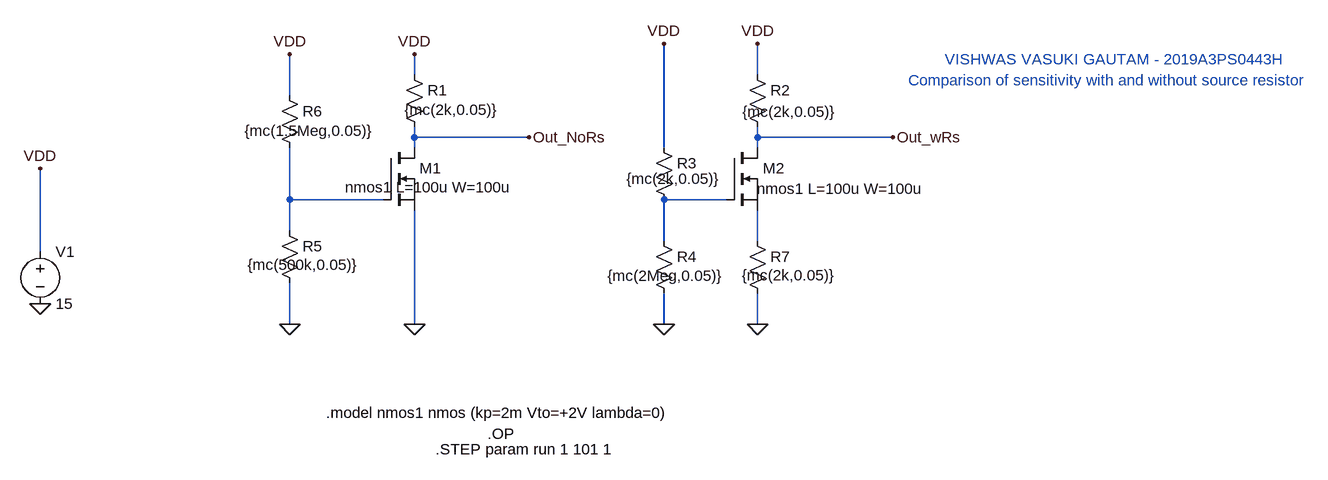
[diagram p0: schematic Sensitivity_in_biasing_lab8.asc]
Sensitivity_in_biasing_lab8.asc, the LTspice schematic file:
Version 4
SHEET 1 1424 680
WIRE -96 -288 -96 -320
WIRE 432 -288 432 -336
WIRE -288 -256 -288 -320
WIRE -96 -192 -96 -208
WIRE 80 -192 -96 -192
WIRE 432 -192 432 -208
WIRE 640 -192 432 -192
WIRE -96 -176 -96 -192
WIRE 288 -176 288 -336
WIRE 432 -176 432 -192
WIRE -288 -96 -288 -176
WIRE -144 -96 -288 -96
WIRE 384 -96 288 -96
WIRE -288 -48 -288 -96
WIRE 288 -32 288 -96
WIRE 432 -32 432 -80
WIRE -672 -16 -672 -144
WIRE -288 96 -288 32
WIRE -96 96 -96 -80
WIRE 288 96 288 48
WIRE 432 96 432 48
FLAG -672 64 0
FLAG -672 -144 VDD
FLAG -288 -320 VDD
FLAG -96 -320 VDD
FLAG 288 -336 VDD
FLAG 432 -336 VDD
FLAG -288 96 0
FLAG -96 96 0
FLAG 288 96 0
FLAG 432 96 0
FLAG 80 -192 Out_NoRs
FLAG 640 -192 Out_wRs
SYMBOL nmos -144 -176 R0
WINDOW 3 200 61 Right 2
SYMATTR Value nmos1 L=100u W=100u
SYMATTR InstName M1
SYMBOL nmos 384 -176 R0
WINDOW 3 47 63 Left 2
SYMATTR Value nmos1 L=100u W=100u
SYMATTR InstName M2
SYMBOL res -112 -304 R0
WINDOW 3 1 70 Left 2
SYMATTR Value {mc(2k,0.05)}
SYMATTR InstName R1
SYMBOL voltage -672 -32 R0
WINDOW 123 0 0 Left 2
WINDOW 39 0 0 Left 2
SYMATTR InstName V1
SYMATTR Value 15
SYMBOL res 416 -304 R0
WINDOW 3 -7 73 Left 2
SYMATTR Value {mc(2k,0.05)}
SYMATTR InstName R2
SYMBOL res 272 -192 R0
WINDOW 3 -42 64 Left 2
SYMATTR Value {mc(2k,0.05)}
SYMATTR InstName R3
SYMBOL res 272 -48 R0
WINDOW 3 -71 69 Left 2
SYMATTR Value {mc(2Meg,0.05)}
SYMATTR InstName R4
SYMBOL res -304 -64 R0
WINDOW 3 -49 68 Left 2
SYMATTR Value {mc(500k,0.05)}
SYMATTR InstName R5
SYMBOL res -304 -272 R0
WINDOW 3 147 70 Right 2
SYMATTR Value {mc(1.5Meg,0.05)}
SYMATTR InstName R6
SYMBOL res 416 -48 R0
WINDOW 3 -8 68 Left 2
SYMATTR Value {mc(2k,0.05)}
SYMATTR InstName R7
TEXT -232 232 Left 2 !.model nmos1 nmos (kp=2m Vto=+2V lambda=0)
TEXT 16 264 Left 2 !.OP
TEXT -64 288 Left 2 !.STEP param run 1 101 1
TEXT 720 -312 Left 2 ;VISHWAS VASUKI GAUTAM - 2019A3PS0443H
TEXT 664 -280 Left 2 ;Comparison of sensitivity with and without source resistor

The netlist it stands for:
* Sensitivity_in_biasing_lab8.asc
M1 Out_NoRs N001 0 0 nmos1 L=100u W=100u
M2 Out_wRs N002 N003 N003 nmos1 L=100u W=100u
R1 VDD Out_NoRs {mc(2k,0.05)}
V1 VDD 0 15
R2 VDD Out_wRs {mc(2k,0.05)}
R3 VDD N002 {mc(2k,0.05)}
R4 N002 0 {mc(2Meg,0.05)}
R5 N001 0 {mc(500k,0.05)}
R6 VDD N001 {mc(1.5Meg,0.05)}
R7 N003 0 {mc(2k,0.05)}
.model NMOS NMOS
.model PMOS PMOS
.lib standard.mos
.model nmos1 nmos (kp=2m Vto=+2V lambda=0)
.OP
.STEP param run 1 101 1
* VISHWAS VASUKI GAUTAM - 2019A3PS0443H
* Comparison of sensitivity with and without source resistor
.backanno
.end